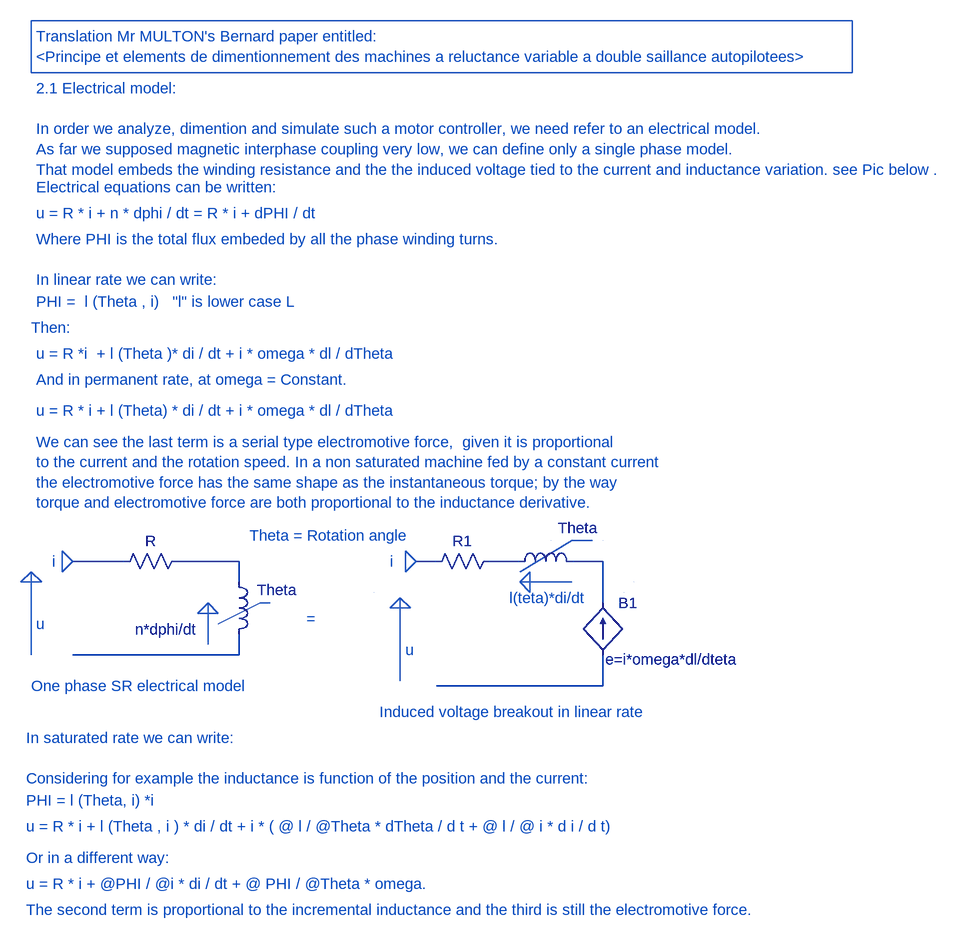
[diagram p0: schematic SwitchedReluctMotorSpiceMulton_translation.asc]
SwitchedReluctMotorSpiceMulton_translation.asc, the LTspice schematic file:
Version 4
SHEET 1 2928 1376
WIRE -64 528 -144 528
WIRE 112 528 16 528
WIRE 112 560 112 528
WIRE 112 672 -144 672
WIRE 112 672 112 640
WIRE 416 528 384 528
WIRE 544 528 496 528
WIRE 672 528 624 528
WIRE 672 592 672 528
WIRE 672 720 416 720
WIRE 672 720 672 672
SYMBOL res 32 512 R90
WINDOW 0 0 56 VBottom 0
WINDOW 3 32 56 VTop 0
SYMATTR InstName R
SYMATTR Value ""
SYMBOL ind 96 544 R0
WINDOW 0 44 28 Left 0
WINDOW 3 -144 89 Left 0
SYMATTR InstName Theta
SYMATTR Value n*dphi/dt
SYMBOL res 512 512 R90
WINDOW 0 0 56 VBottom 0
WINDOW 3 32 56 VTop 0
SYMATTR InstName R1
SYMATTR Value ""
SYMBOL ind 528 544 R270
WINDOW 0 52 106 VTop 0
WINDOW 3 263 -67 VBottom 0
SYMATTR InstName Theta
SYMATTR Value ""
SYMBOL bi2 672 592 R0
WINDOW 3 4 87 Left 0
SYMATTR InstName B1
SYMATTR Value e=i*omega*dl/dteta
TEXT -176 528 Left 0 ;i
TEXT -200 624 Left 0 ;u
TEXT 216 616 Left 0 ;=
TEXT 344 528 Left 0 ;i
TEXT 368 664 Left 0 ;u
TEXT 528 584 Left 0 ;l(teta)*di/dt
TEXT -208 720 Left 0 ;One phase SR electrical model
TEXT 328 760 Left 0 ;Induced voltage breakout in linear rate
TEXT -200 -280 Left 0 ;Translation Mr MULTON's Bernard paper entitled:\n<Principe et elements de dimentionnement des machines a reluctance variable a double saillance autopilotees>
TEXT -200 -200 Left 0 ;2.1 Electrical model:\n \nIn order we analyze, dimention and simulate such a motor controller, we need refer to an electrical model.\nAs far we supposed magnetic interphase coupling very low, we can define only a single phase model.\nThat model embeds the winding resistance and the the induced voltage tied to the current and inductance variation. see Pic below .
TEXT -200 -48 Left 0 ;Electrical equations can be written:
TEXT -200 32 Left 0 ;Where PHI is the total flux embeded by all the phase winding turns.\n \nIn linear rate we can write:
TEXT -208 168 Left 0 ;Then:
TEXT -200 248 Left 0 ;And in permanent rate, at omega = Constant.
TEXT -200 344 Left 0 ;We can see the last term is a serial type electromotive force,  given it is proportional \nto the current and the rotation speed. In a non saturated machine fed by a constant current\nthe electromotive force has the same shape as the instantaneous torque; by the way\ntorque and electromotive force are both proportional to the inductance derivative.
TEXT -216 800 Left 0 ;In saturated rate we can write:\n \nConsidering for example the inductance is function of the position and the current:
TEXT -216 984 Left 0 ;Or in a different way:
TEXT -216 1064 Left 0 ;The second term is proportional to the incremental inductance and the third is still the electromotive force.
TEXT -200 -8 Left 0 ;u = R * i + n * dphi / dt = R * i + dPHI / dt
TEXT -200 128 Left 0 ;PHI =  l (Theta , i)   "l" is lower case L
TEXT -200 208 Left 0 ;u = R *i  + l (Theta )* di / dt + i * omega * dl / dTheta
TEXT -200 296 Left 0 ;u = R * i + l (Theta) * di / dt + i * omega * dl / dTheta
TEXT -216 896 Left 0 ;PHI = l (Theta, i) *i
TEXT -216 936 Left 0 ;u = R * i + l (Theta , i ) * di / dt + i * ( @ l / @Theta * dTheta / d t + @ l / @ i * d i / d t)
TEXT -216 1024 Left 0 ;u = R * i + @PHI / @i * di / dt + @ PHI / @Theta * omega.
TEXT 128 488 Left 0 ;Theta = Rotation angle
LINE Normal 144 592 80 624
LINE Normal 144 592 144 592
LINE Normal 160 592 144 592
LINE Normal 64 656 64 592
LINE Normal 64 592 64 592
LINE Normal 64 592 64 592
LINE Normal 48 608 64 592
LINE Normal 48 608 48 608
LINE Normal 64 608 64 592
LINE Normal 64 592 64 608
LINE Normal 80 608 64 592
LINE Normal -160 512 -144 528
LINE Normal -160 544 -160 512
LINE Normal -160 544 -160 544
LINE Normal -160 544 -160 544
LINE Normal -144 528 -160 544
LINE Normal 80 608 48 608
LINE Normal 80 608 80 608
LINE Normal -208 672 -208 544
LINE Normal -224 560 -208 544
LINE Normal -192 560 -224 560
LINE Normal -208 544 -192 560
LINE Normal 320 576 320 576
LINE Normal 592 496 592 496
LINE Normal 720 560 720 560
LINE Normal 720 560 720 560
LINE Normal 704 576 704 576
LINE Normal 368 512 384 528
LINE Normal 368 544 368 512
LINE Normal 368 544 368 544
LINE Normal 368 544 368 544
LINE Normal 384 528 368 544
LINE Normal 608 560 608 560
LINE Normal 360 712 360 584
LINE Normal 344 600 360 584
LINE Normal 376 600 344 600
LINE Normal 360 584 376 600
LINE Normal 624 496 544 544
LINE Normal 656 496 624 496
LINE Normal 672 496 672 496
LINE Normal 560 560 624 560
LINE Normal 560 560 560 560
LINE Normal 560 560 560 560
LINE Normal 544 560 560 560
LINE Normal 560 544 544 560
LINE Normal 560 576 560 544
LINE Normal 544 560 560 576
RECTANGLE Normal 1056 -224 -208 -304

The netlist it stands for:
* SwitchedReluctMotorSpiceMulton_translation.asc
R N002 N001
L§Theta N002 N003 n*dphi/dt
R1 N005 N004
L§Theta N005 N006
B1 N007 N006 e=i*omega*dl/dteta
* i
* u
* =
* i
* u
* l(teta)*di/dt
* One phase SR electrical model
* Induced voltage breakout in linear rate
* Translation Mr MULTON's Bernard paper entitled:
* <Principe et elements de dimentionnement des machines a reluctance variable a double saillance autopilotees>
* 2.1 Electrical model:
* In order we analyze, dimention and simulate such a motor controller, we need refer to an electrical model.
* As far we supposed magnetic interphase coupling very low, we can define only a single phase model.
* That model embeds the winding resistance and the the induced voltage tied to the current and inductance variation. see Pic below .
* Electrical equations can be written:
* Where PHI is the total flux embeded by all the phase winding turns.
* In linear rate we can write:
* Then:
* And in permanent rate, at omega = Constant.
* We can see the last term is a serial type electromotive force,  given it is proportional
* to the current and the rotation speed. In a non saturated machine fed by a constant current
* the electromotive force has the same shape as the instantaneous torque; by the way
* torque and electromotive force are both proportional to the inductance derivative.
* In saturated rate we can write:
* Considering for example the inductance is function of the position and the current:
* Or in a different way:
* The second term is proportional to the incremental inductance and the third is still the electromotive force.
* u = R * i + n * dphi / dt = R * i + dPHI / dt
* PHI =  l (Theta , i)   "l" is lower case L
* u = R *i  + l (Theta )* di / dt + i * omega * dl / dTheta
* u = R * i + l (Theta) * di / dt + i * omega * dl / dTheta
* PHI = l (Theta, i) *i
* u = R * i + l (Theta , i ) * di / dt + i * ( @ l / @Theta * dTheta / d t + @ l / @ i * d i / d t)
* u = R * i + @PHI / @i * di / dt + @ PHI / @Theta * omega.
* Theta = Rotation angle
.backanno
.end